# Altium schematic sheet Sheet1(without_res_cap).SchDoc
size A
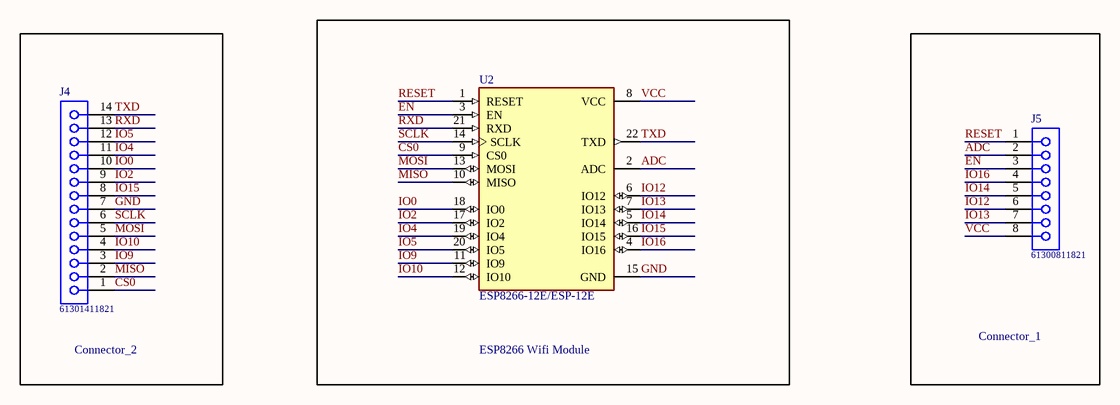
[diagram p0: Sheet1(without_res_cap).SchDoc]

## Parts
J4  61301411821  [61301411821]
J5  61300811821  [61300811821]
U2  ESP8266-12E/ESP-12E  [XCVR_ESP8266-12E/ESP-12E]

## Blocks framed on the sheet
Connector_2: J4
ESP8266 Wifi Module: U2
Connector_1: J5

## Nets
ADC: J5.2 U2.2(ADC)
CS0: J4.1 U2.9(CS0)
EN: J5.3 U2.3(EN)
GND: J4.7 U2.15(GND)
IO0: J4.10 U2.18(IO0)
IO2: J4.9 U2.17(IO2)
IO4: J4.11 U2.19(IO4)
IO5: J4.12 U2.20(IO5)
IO9: J4.3 U2.11(IO9)
IO10: J4.4 U2.12(IO10)
IO12: J5.6 U2.6(IO12)
IO13: J5.7 U2.7(IO13)
IO14: J5.5 U2.5(IO14)
IO15: J4.8 U2.16(IO15)
IO16: J5.4 U2.4(IO16)
MISO: J4.2 U2.10(MISO)
MOSI: J4.5 U2.13(MOSI)
RESET: J5.1 U2.1(RESET)
RXD: J4.13 U2.21(RXD)
SCLK: J4.6 U2.14(SCLK)
TXD: J4.14 U2.22(TXD)
VCC: J5.8 U2.8(VCC)

## Library data of the parts
J4 = 61301411821: WR-PHD Socket Header, THT, pitch 2.54mm, Single Row, Vertical, 14p; Manufacturer: Wurth Elektronik; Pin Number: 14; Rated Current: 3A; Working Voltage: 250VAC; Withstanding Voltage: 500VAC; Contact Resistance: 20mOhm; ComponentLink1Description: Manufacturer; ComponentLink1URL: http://www.we-online.de; ComponentLink2Description: Datasheet; ComponentLink2URL: https://www.we-online.com/catalog/datasheet/61301411821.pdf; Manufacturer Part Number: 61301411821; Published Date: May 2020; Pitch: 2.54mm; Operating Temperature: -40 to +125degC; Mounting Technology: THT; Packaging: Tray; Gender: Socket Header; Row Number: Single; Orientation: Vertical
J5 = 61300811821: WR-PHD Socket Header, THT, pitch 2.54mm, Single Row, Vertical, 8p; Manufacturer: Wurth Elektronik; Pin Number: 8; Rated Current: 3A; Working Voltage: 250VAC; Withstanding Voltage: 500VAC; Contact Resistance: 20mOhm; ComponentLink1Description: Manufacturer; ComponentLink1URL: http://www.we-online.de; ComponentLink2Description: Datasheet; ComponentLink2URL: https://www.we-online.com/catalog/datasheet/61300811821.pdf; Manufacturer Part Number: 61300811821; Published Date: May 2020; Pitch: 2.54mm; Operating Temperature: -40 to +125degC; Mounting Technology: THT; Packaging: Tray; Gender: Socket Header; Row Number: Single; Orientation: Vertical
U2 = ESP8266-12E/ESP-12E: This WiFi module has a 32-bit MCU micro and clock speeds supporting 80 MHz or 160 MHz. Supports the RTOS and integrated Wi-Fi MAC/BB/RF/PA/LNA, and has an on-board antenna.; MF: AI-Thinker; Price: None; Package: None; Value: *; MP: ESP8266-12E/ESP-12E; Availability: Unavailable; SnapEDA_Link: https://www.snapeda.com/parts/ESP8266-12E/ESP-12E/AI-Thinker/view-part/106414/?ref=snap